# EAGLE schematic all_in_one_v2 (EAGLE 4.16)
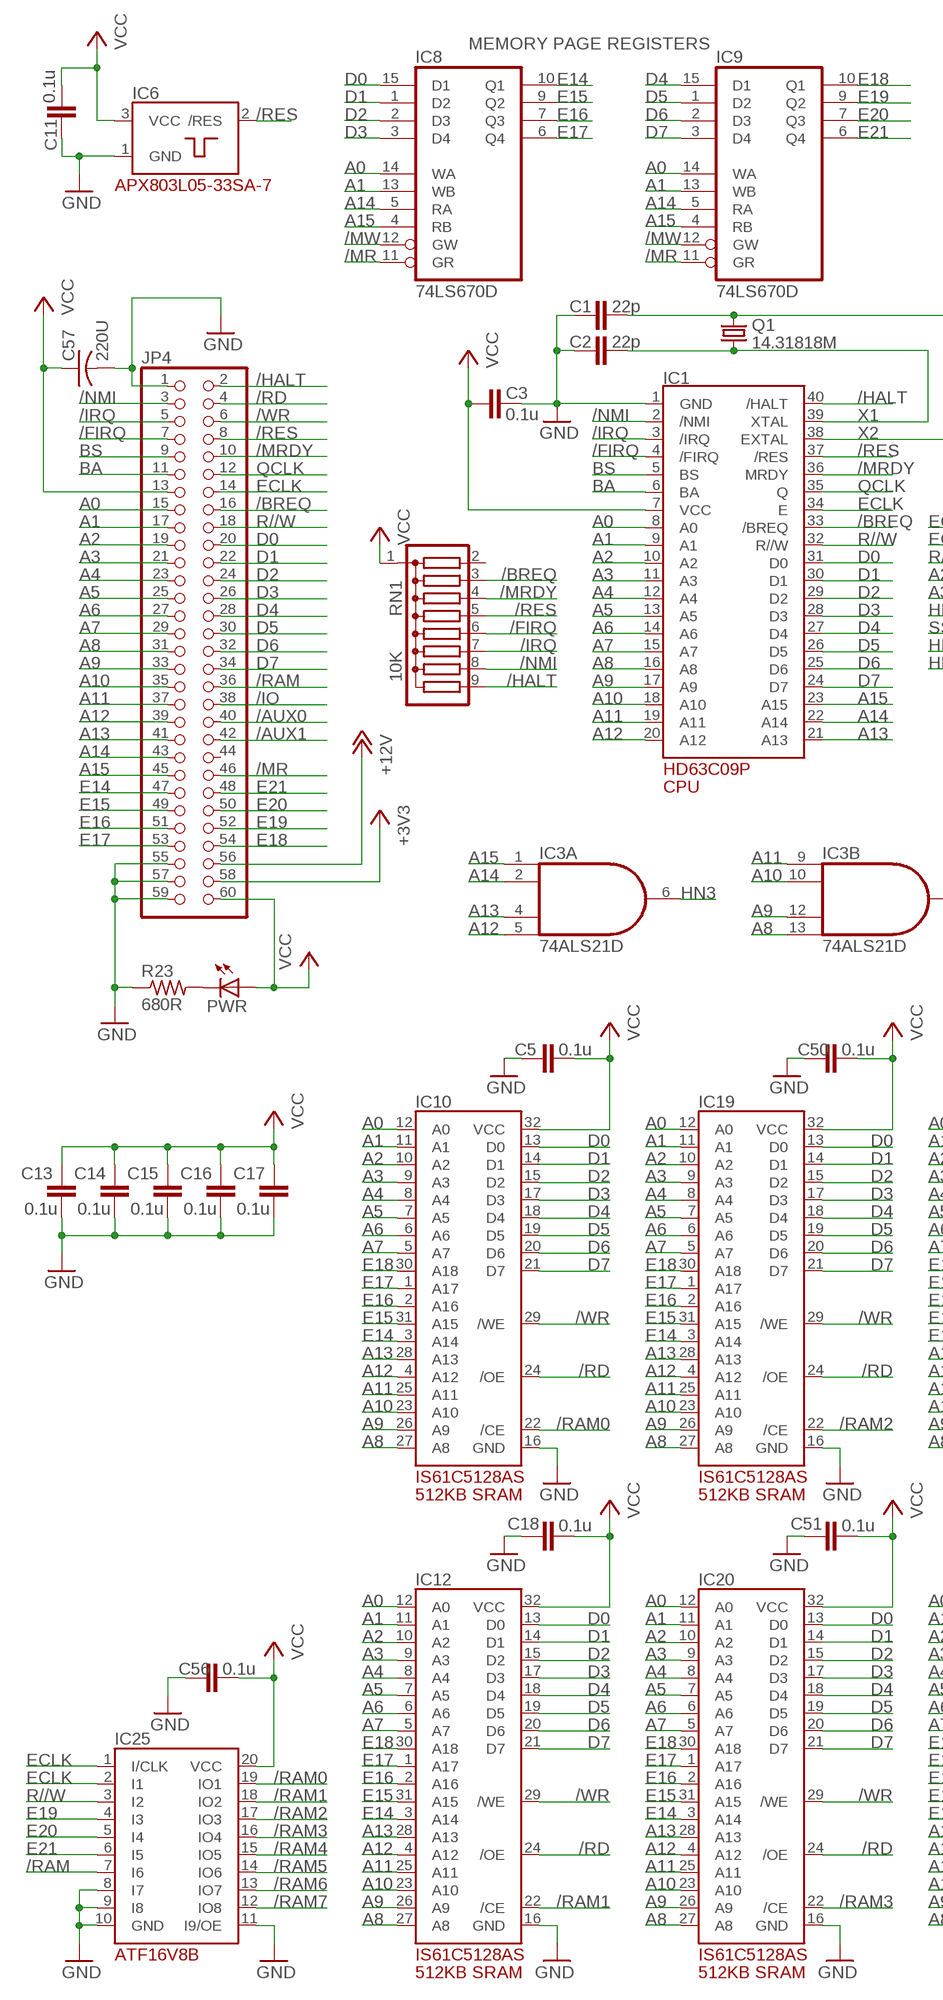
[diagram p0: schematic, sheet 1, part 1 of 2]
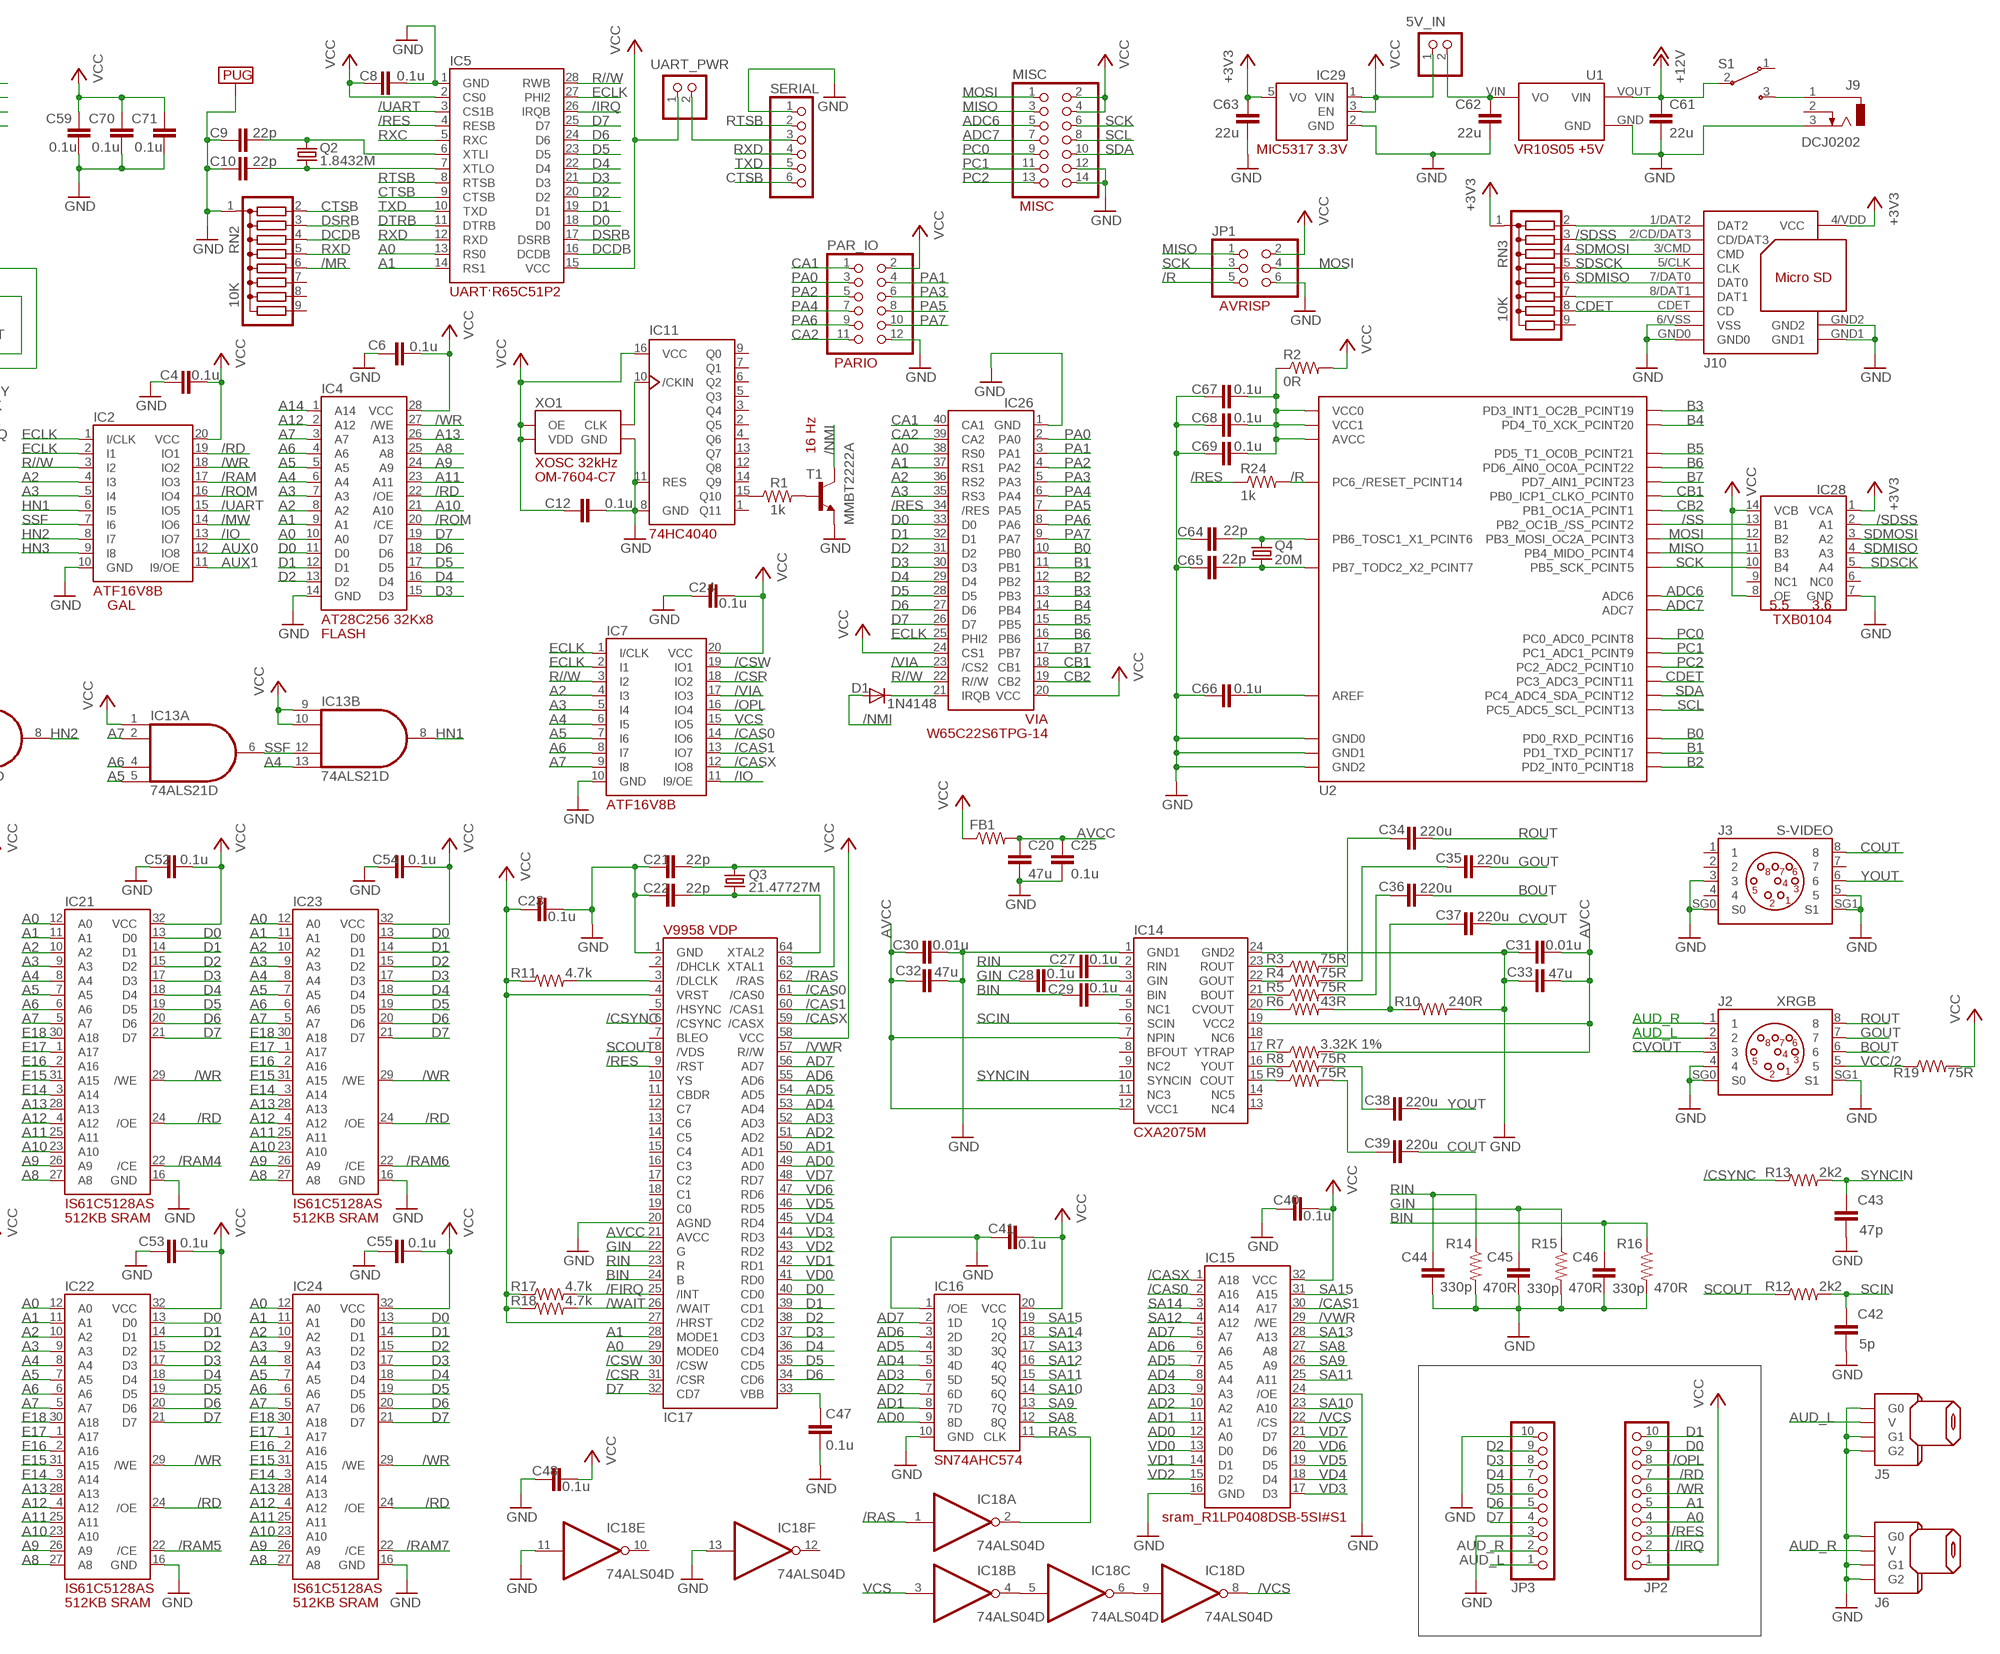
[diagram p1: schematic, sheet 1, part 2 of 2]

## Parts
5V_IN  PINHD-1X2  [1X02]
C1  22p  C-EUC0603  [C0603]
C2  22p  C-EUC0603  [C0603]
C3  0.1u  C-EUC0603  [C0603]
C4  0.1u  C-EUC0603  [C0603]
C5  0.1u  C-EUC0603  [C0603]
C6  0.1u  C-EUC0603  [C0603]
C8  0.1u  C-EUC0603  [C0603]
C9  22p  C-EUC0603  [C0603]
C10  22p  C-EUC0603  [C0603]
C11  0.1u  C-EUC0603  [C0603]
C12  0.1u  C-EUC0603  [C0603]
C13  0.1u  C-EUC0603  [C0603]
C14  0.1u  C-EUC0603  [C0603]
C15  0.1u  C-EUC0603  [C0603]
C16  0.1u  C-EUC0603  [C0603]
C17  0.1u  C-EUC0603  [C0603]
C18  0.1u  C-EUC0603  [C0603]
C20  47u  C-EUC0805  [C0805]
C21  22p  C-EUC0603  [C0603]
C22  22p  C-EUC0603  [C0603]
C23  0.1u  C-EUC0603  [C0603]
C24  0.1u  C-EUC0603  [C0603]
C25  0.1u  C-EUC0603  [C0603]
C27  0.1u  C-EUC0603  [C0603]
C28  0.1u  C-EUC0603  [C0603]
C29  0.1u  C-EUC0603  [C0603]
C30  0.01u  C-EUC0603  [C0603]
C31  0.01u  C-EUC0603  [C0603]
C32  47u  C-EUC0805  [C0805]
C33  47u  C-EUC0805  [C0805]
C34  220u  C-EUC1206  [C1206]
C35  220u  C-EUC1206  [C1206]
C36  220u  C-EUC1206  [C1206]
C37  220u  C-EUC1206  [C1206]
C38  220u  C-EUC1206  [C1206]
C39  220u  C-EUC1206  [C1206]
C40  0.1u  C-EUC0603  [C0603]
C41  0.1u  C-EUC0603  [C0603]
C42  5p  C-EUC0603  [C0603]
C43  47p  C-EUC0603  [C0603]
C44  330p  C-EUC0603  [C0603]
C45  330p  C-EUC0603  [C0603]
C46  330p  C-EUC0603  [C0603]
C47  0.1u  C-EUC0603  [C0603]
C48  0.1u  C-EUC0603  [C0603]
C50  0.1u  C-EUC0603  [C0603]
C51  0.1u  C-EUC0603  [C0603]
C52  0.1u  C-EUC0603  [C0603]
C53  0.1u  C-EUC0603  [C0603]
C54  0.1u  C-EUC0603  [C0603]
C55  0.1u  C-EUC0603  [C0603]
C56  0.1u  C-EUC0603  [C0603]
C57  220U  C-US025-050X050  [C025-050X050]
C59  0.1u  C-EUC0603  [C0603]
C61  22u  C-EUC1206  [C1206]
C62  22u  C-EUC1206  [C1206]
C63  22u  C-EUC0805  [C0805]
C64  22p  C-EUC0603  [C0603]
C65  22p  C-EUC0603  [C0603]
C66  0.1u  C-EUC0603  [C0603]
C67  0.1u  C-EUC0603  [C0603]
C68  0.1u  C-EUC0603  [C0603]
C69  0.1u  C-EUC0603  [C0603]
C70  0.1u  C-EUC0603  [C0603]
C71  0.1u  C-EUC0603  [C0603]
D1  1N4148  [DO35-10]
FB1  R-US_R0603  [R0603]
IC1  HD63C09P  [DIL40]
IC2  PLD_ATF16V8B  [DIL20]
IC3  74ALS21D  [SO14]
IC4  EEP_32KX8_AT28C256  [DIL28-6]
IC5  UART_W65C51N  [DIL28-6]
IC6  POR_APX803L05-33SA-7  [SOT23]
IC7  PLD_ATF16V8B  [DIL20]
IC8  74LS670D  [SO16]
IC9  74LS670D  [SO16]
IC10  IS61C5128AS  [SOIC32_11.3MM_WID]
IC11  74HC4040D  [SO16]
IC12  IS61C5128AS  [SOIC32_11.3MM_WID]
IC13  74ALS21D  [SO14]
IC14  CXA2075M  [CXA2075M]
IC15  R1LP0408DSB-5SI#S1  [RENESAS_32-TSOP-II]
IC16  SN74AHC574PWRSO  [SOIC20]
IC17  YAMAHA_V9958  [V9958]
IC18  74ALS04D  [SO14]
IC19  IS61C5128AS  [SOIC32_11.3MM_WID]
IC20  IS61C5128AS  [SOIC32_11.3MM_WID]
IC21  IS61C5128AS  [SOIC32_11.3MM_WID]
IC22  IS61C5128AS  [SOIC32_11.3MM_WID]
IC23  IS61C5128AS  [SOIC32_11.3MM_WID]
IC24  IS61C5128AS  [SOIC32_11.3MM_WID]
IC25  PLD_ATF16V8B  [DIL20]
IC26  W65C22S6TBG-14  [DIL40]
IC28  TXB0104D  [SOIC14]
IC29  MIC5317_3.3V  [SOT23-5]
J2  XRGB  MINI-DIN8  [MINI_DIN8]
J3  S-VIDEO  MINI-DIN8  [MINI_DIN8]
J5  RCA_CONN_CUI_RCJ-014_CP-1403-ND  [RCA_JACK_CUI_RCJ-014_CP-1403-ND]
J6  RCA_CONN_CUI_RCJ-014_CP-1403-ND  [RCA_JACK_CUI_RCJ-014_CP-1403-ND]
J9  DCJ0202  [DCJ0202]
J10  MICROSD_AMPHENOL_GTFP084328  [MICROSD_AMPHENOL_GTFP08432B1HR]
JP1  PINHD-2X3  [2X03]
JP2  PINHD-1X10  [1X10]
JP3  PINHD-1X10  [1X10]
JP4  PINHD-2X30  [2X30]
MISC  PINHD-2X7  [2X07]
PAR_IO  PINHD-2X6  [2X06]
PWR  LED3MM  [LED3MM]
Q1  14.31818M  CRYSTALHC49S  [HC49/S]
Q2  1.8432M  CRYSTALHC49S  [HC49/S]
Q3  21.47727M  CRYSTALHC49S  [HC49/S]
Q4  20M  CRYSTALHC49S  [HC49/S]
R1  1k  R-US_R0603  [R0603]
R2  0R  R-US_R0603  [R0603]
R3  75R  R-US_R0603  [R0603]
R4  75R  R-US_R0603  [R0603]
R5  75R  R-US_R0603  [R0603]
R6  43R  R-US_R0603  [R0603]
R7  3.32K 1%  R-US_R0603  [R0603]
R8  75R  R-US_R0603  [R0603]
R9  75R  R-US_R0603  [R0603]
R10  240R  R-US_R0603  [R0603]
R11  4.7k  R-US_R0603  [R0603]
R12  2k2  R-US_R0603  [R0603]
R13  2k2  R-US_R0603  [R0603]
R14  470R  R-US_R0603  [R0603]
R15  470R  R-US_R0603  [R0603]
R16  470R  R-US_R0603  [R0603]
R17  4.7k  R-US_R0603  [R0603]
R18  4.7k  R-US_R0603  [R0603]
R19  75R  R-US_R0603  [R0603]
R23  680R  R-US_R0603  [R0603]
R24  1k  R-US_R0603  [R0603]
RN1  10K  G08R  [SIL9]
RN2  10K  G08R  [SIL9]
RN3  10K  G08R  [SIL9]
S1  ROCKEREG4328-ND  [ROCKER_SPDT_EG4328-ND]
SERIAL  PINHD-1X6  [1X06]
T1  MMBT2222A  MMBT2222ALT1-NPN-SOT23-BEC  [SOT23-BEC]
U1  VREG_5V_VR10S05  [VREG_5V_CP_POWER_VR10S05]
U2  ATMEGA238PTQFP_  [TQFP32-08]
U$2  PUG  [LARGE_PUG]
UART_PWR  PINHD-1X2  [1X02]
XO1  XODC_32KHZ_OM-7604-C7  [32K_XO_OM-7604-C7]

## Nets
+3V3 [supply]: C63.1 IC28.1(VCA) IC29.5(VO) J10.4/VDD(VCC) JP4.58 RN3.1
+12V [supply]: C61.1 JP4.56 S1.2 U1.VOUT(VIN)
/AUX0: JP4.40
/AUX1: JP4.42
/BREQ: IC1.33(/BREQ) JP4.16 RN1.3
/CAS0: IC7.14(IO6) IC15.2(A16) IC17.61(/CAS0)
/CAS1: IC7.13(IO7) IC15.30(A17) IC17.60(/CAS1)
/CASX: IC7.12(IO8) IC15.1(A18) IC17.59(/CASX)
/CSR: IC7.18(IO2) IC17.31(/CSR)
/CSW: IC7.19(IO1) IC17.30(/CSW)
/CSYNC: IC17.6(/CSYNC) R13.1
/DLCLK: IC17.3(/DLCLK) R11.2
/FIRQ: IC1.4(/FIRQ) IC17.25(/INT) JP4.7 R17.2 RN1.6
/HALT: IC1.40(/HALT) JP4.2 RN1.9
/IO: IC2.13(IO7) IC7.11(I9/OE) JP4.38
/IRQ: IC1.3(/IRQ) IC5.26(IRQB) JP2.2 JP4.5 RN1.7
/MR: IC8.11(GR) IC9.11(GR) JP4.46 RN2.6
/MRDY: IC1.36(MRDY) JP4.10 RN1.4
/MW: IC2.14(IO6) IC8.12(GW) IC9.12(GW)
/NMI: D1.A IC1.2(/NMI) JP4.3 RN1.8 T1.C
/OPL: IC7.16(IO4) JP2.8
/R: JP1.5 R24.2 U2.29(PC6_/RESET_PCINT14)
/RAM: IC2.17(IO3) IC25.7(I6) JP4.36
/RAM0: IC10.22(/CE) IC25.19(IO1)
/RAM1: IC12.22(/CE) IC25.18(IO2)
/RAM2: IC19.22(/CE) IC25.17(IO3)
/RAM3: IC20.22(/CE) IC25.16(IO4)
/RAM4: IC21.22(/CE) IC25.15(IO5)
/RAM5: IC22.22(/CE) IC25.14(IO6)
/RAM6: IC23.22(/CE) IC25.13(IO7)
/RAM7: IC24.22(/CE) IC25.12(IO8)
/RAS: IC17.62(/RAS) IC18.1(A:I)
/RD: IC2.19(IO1) IC4.22(/OE) IC10.24(/OE) IC12.24(/OE) IC19.24(/OE) IC20.24(/OE) IC21.24(/OE) IC22.24(/OE) IC23.24(/OE) IC24.24(/OE) JP2.7 JP4.4
/RES: IC1.37(/RES) IC5.4(RESB) IC6.2(/RES) IC17.9(/RST) IC26.34(/RES) JP2.3 JP4.8 R24.1 RN1.5
/ROM: IC2.16(IO4) IC4.20(/CE)
/SDSS: IC28.2(A1) J10.2/CD/DAT3(CD/DAT3) RN3.3
/SS: IC28.13(B1) U2.14(PB2_OC1B_/SS_PCINT2)
/UART: IC2.15(IO5) IC5.3(CS1B)
/VCS: IC15.22(/CS) IC18.8(D:O)
/VIA: IC7.17(IO3) IC26.23(/CS2)
/VWR: IC15.29(/WE) IC17.57(R//W)
/WAIT: IC17.26(/WAIT) R18.2
/WR: IC2.18(IO2) IC4.27(/WE) IC10.29(/WE) IC12.29(/WE) IC19.29(/WE) IC20.29(/WE) IC21.29(/WE) IC22.29(/WE) IC23.29(/WE) IC24.29(/WE) JP2.6 JP4.6
A0: IC1.8(A0) IC4.10(A0) IC5.13(RS0) IC8.14(WA) IC9.14(WA) IC10.12(A0) IC12.12(A0) IC17.29(MODE0) IC19.12(A0) IC20.12(A0) IC21.12(A0) IC22.12(A0) IC23.12(A0) IC24.12(A0) IC26.38(RS0) JP2.4 JP4.15
A1: IC1.9(A1) IC4.9(A1) IC5.14(RS1) IC8.13(WB) IC9.13(WB) IC10.11(A1) IC12.11(A1) IC17.28(MODE1) IC19.11(A1) IC20.11(A1) IC21.11(A1) IC22.11(A1) IC23.11(A1) IC24.11(A1) IC26.37(RS1) JP2.5 JP4.17
A2: IC1.10(A2) IC2.4(I3) IC4.8(A2) IC7.4(I3) IC10.10(A2) IC12.10(A2) IC19.10(A2) IC20.10(A2) IC21.10(A2) IC22.10(A2) IC23.10(A2) IC24.10(A2) IC26.36(RS2) JP4.19
A3: IC1.11(A3) IC2.5(I4) IC4.7(A3) IC7.5(I4) IC10.9(A3) IC12.9(A3) IC19.9(A3) IC20.9(A3) IC21.9(A3) IC22.9(A3) IC23.9(A3) IC24.9(A3) IC26.35(RS3) JP4.21
A4: IC1.12(A4) IC4.6(A4) IC7.6(I5) IC10.8(A4) IC12.8(A4) IC13.13(B:I3) IC19.8(A4) IC20.8(A4) IC21.8(A4) IC22.8(A4) IC23.8(A4) IC24.8(A4) JP4.23
A5: IC1.13(A5) IC4.5(A5) IC7.7(I6) IC10.7(A5) IC12.7(A5) IC13.5(A:I3) IC19.7(A5) IC20.7(A5) IC21.7(A5) IC22.7(A5) IC23.7(A5) IC24.7(A5) JP4.25
A6: IC1.14(A6) IC4.4(A6) IC7.8(I7) IC10.6(A6) IC12.6(A6) IC13.4(A:I2) IC19.6(A6) IC20.6(A6) IC21.6(A6) IC22.6(A6) IC23.6(A6) IC24.6(A6) JP4.27
A7: IC1.15(A7) IC4.3(A7) IC7.9(I8) IC10.5(A7) IC12.5(A7) IC13.2(A:I1) IC19.5(A7) IC20.5(A7) IC21.5(A7) IC22.5(A7) IC23.5(A7) IC24.5(A7) JP4.29
A8: IC1.16(A8) IC3.13(B:I3) IC4.25(A8) IC10.27(A8) IC12.27(A8) IC19.27(A8) IC20.27(A8) IC21.27(A8) IC22.27(A8) IC23.27(A8) IC24.27(A8) JP4.31
A9: IC1.17(A9) IC3.12(B:I2) IC4.24(A9) IC10.26(A9) IC12.26(A9) IC19.26(A9) IC20.26(A9) IC21.26(A9) IC22.26(A9) IC23.26(A9) IC24.26(A9) JP4.33
A10: IC1.18(A10) IC3.10(B:I1) IC4.21(A10) IC10.23(A10) IC12.23(A10) IC19.23(A10) IC20.23(A10) IC21.23(A10) IC22.23(A10) IC23.23(A10) IC24.23(A10) JP4.35
A11: IC1.19(A11) IC3.9(B:I0) IC4.23(A11) IC10.25(A11) IC12.25(A11) IC19.25(A11) IC20.25(A11) IC21.25(A11) IC22.25(A11) IC23.25(A11) IC24.25(A11) JP4.37
A12: IC1.20(A12) IC3.5(A:I3) IC4.2(A12) IC10.4(A12) IC12.4(A12) IC19.4(A12) IC20.4(A12) IC21.4(A12) IC22.4(A12) IC23.4(A12) IC24.4(A12) JP4.39
A13: IC1.21(A13) IC3.4(A:I2) IC4.26(A13) IC10.28(A13) IC12.28(A13) IC19.28(A13) IC20.28(A13) IC21.28(A13) IC22.28(A13) IC23.28(A13) IC24.28(A13) JP4.41
A14: IC1.22(A14) IC3.2(A:I1) IC4.1(A14) IC8.5(RA) IC9.5(RA) JP4.43
A15: IC1.23(A15) IC3.1(A:I0) IC8.4(RB) IC9.4(RB) JP4.45
AD0: IC15.12(A0) IC16.9(8D) IC17.49(AD0)
AD1: IC15.11(A1) IC16.8(7D) IC17.50(AD1)
AD2: IC15.10(A2) IC16.7(6D) IC17.51(AD2)
AD3: IC15.9(A3) IC16.6(5D) IC17.52(AD3)
AD4: IC15.8(A4) IC16.5(4D) IC17.53(AD4)
AD5: IC15.7(A5) IC16.4(3D) IC17.54(AD5)
AD6: IC15.6(A6) IC16.3(2D) IC17.55(AD6)
AD7: IC15.5(A7) IC16.2(1D) IC17.56(AD7)
ADC6: MISC.5 U2.19(ADC6)
ADC7: MISC.7 U2.22(ADC7)
AUD_L: J2.2 J5.V JP3.1
AUD_R: J2.1 J6.V JP3.2
AUX0: IC2.12(IO8)
AUX1: IC2.11(I9/OE)
AVCC [supply]: C20.1 C25.1 C30.1 C31.2 C32.1 C33.2 FB1.2 IC14.7(NPIN) IC14.12(VCC1) IC14.19(VCC2) IC17.21(AVCC) R7.2
B0: IC26.10(PB0) U2.30(PD0_RXD_PCINT16)
B1: IC26.11(PB1) U2.31(PD1_TXD_PCINT17)
B2: IC26.12(PB2) U2.32(PD2_INT0_PCINT18)
B3: IC26.13(PB3) U2.1(PD3_INT1_OC2B_PCINT19)
B4: IC26.14(PB4) U2.2(PD4_T0_XCK_PCINT20)
B5: IC26.15(PB5) U2.9(PD5_T1_OC0B_PCINT21)
B6: IC26.16(PB6) U2.10(PD6_AIN0_OC0A_PCINT22)
B7: IC26.17(PB7) U2.11(PD7_AIN1_PCINT23)
BA: IC1.6(BA) JP4.11
BIN: C29.1 C46.1 IC17.24(B) R16.1
BOUT: C36.2 J2.6
BS: IC1.5(BS) JP4.9
CA1: IC26.40(CA1) PAR_IO.1
CA2: IC26.39(CA2) PAR_IO.11
CB1: IC26.18(CB1) U2.12(PB0_ICP1_CLKO_PCINT0)
CB2: IC26.19(CB2) U2.13(PB1_OC1A_PCINT1)
CDET: J10.CDET(CD) RN3.8 U2.26(PC3_ADC3_PCINT11)
COUT: C39.2 J3.8
CTSB: IC5.9(CTSB) RN2.2 SERIAL.6
CVOUT: C37.2 J2.3
D0: IC1.31(D0) IC4.11(D0) IC5.18(D0) IC8.15(D1) IC10.13(D0) IC12.13(D0) IC17.40(CD0) IC19.13(D0) IC20.13(D0) IC21.13(D0) IC22.13(D0) IC23.13(D0) IC24.13(D0) IC26.33(D0) JP2.9 JP4.20
D1: IC1.30(D1) IC4.12(D1) IC5.19(D1) IC8.1(D2) IC10.14(D1) IC12.14(D1) IC17.39(CD1) IC19.14(D1) IC20.14(D1) IC21.14(D1) IC22.14(D1) IC23.14(D1) IC24.14(D1) IC26.32(D1) JP2.10 JP4.22
D2: IC1.29(D2) IC4.13(D2) IC5.20(D2) IC8.2(D3) IC10.15(D2) IC12.15(D2) IC17.38(CD2) IC19.15(D2) IC20.15(D2) IC21.15(D2) IC22.15(D2) IC23.15(D2) IC24.15(D2) IC26.31(D2) JP3.9 JP4.24
D3: IC1.28(D3) IC4.15(D3) IC5.21(D3) IC8.3(D4) IC10.17(D3) IC12.17(D3) IC17.37(CD3) IC19.17(D3) IC20.17(D3) IC21.17(D3) IC22.17(D3) IC23.17(D3) IC24.17(D3) IC26.30(D3) JP3.8 JP4.26
D4: IC1.27(D4) IC4.16(D4) IC5.22(D4) IC9.15(D1) IC10.18(D4) IC12.18(D4) IC17.36(CD4) IC19.18(D4) IC20.18(D4) IC21.18(D4) IC22.18(D4) IC23.18(D4) IC24.18(D4) IC26.29(D4) JP3.7 JP4.28
D5: IC1.26(D5) IC4.17(D5) IC5.23(D5) IC9.1(D2) IC10.19(D5) IC12.19(D5) IC17.35(CD5) IC19.19(D5) IC20.19(D5) IC21.19(D5) IC22.19(D5) IC23.19(D5) IC24.19(D5) IC26.28(D5) JP3.6 JP4.30
D6: IC1.25(D6) IC4.18(D6) IC5.24(D6) IC9.2(D3) IC10.20(D6) IC12.20(D6) IC17.34(CD6) IC19.20(D6) IC20.20(D6) IC21.20(D6) IC22.20(D6) IC23.20(D6) IC24.20(D6) IC26.27(D6) JP3.5 JP4.32
D7: IC1.24(D7) IC4.19(D7) IC5.25(D7) IC9.3(D4) IC10.21(D7) IC12.21(D7) IC17.32(CD7) IC19.21(D7) IC20.21(D7) IC21.21(D7) IC22.21(D7) IC23.21(D7) IC24.21(D7) IC26.26(D7) JP3.4 JP4.34
DCDB: IC5.16(DCDB) RN2.4
DSRB: IC5.17(DSRB) RN2.3
DTRB: IC5.11(DTRB)
E14: IC8.10(Q1) IC10.3(A14) IC12.3(A14) IC19.3(A14) IC20.3(A14) IC21.3(A14) IC22.3(A14) IC23.3(A14) IC24.3(A14) JP4.47
E15: IC8.9(Q2) IC10.31(A15) IC12.31(A15) IC19.31(A15) IC20.31(A15) IC21.31(A15) IC22.31(A15) IC23.31(A15) IC24.31(A15) JP4.49
E16: IC8.7(Q3) IC10.2(A16) IC12.2(A16) IC19.2(A16) IC20.2(A16) IC21.2(A16) IC22.2(A16) IC23.2(A16) IC24.2(A16) JP4.51
E17: IC8.6(Q4) IC10.1(A17) IC12.1(A17) IC19.1(A17) IC20.1(A17) IC21.1(A17) IC22.1(A17) IC23.1(A17) IC24.1(A17) JP4.53
E18: IC9.10(Q1) IC10.30(A18) IC12.30(A18) IC19.30(A18) IC20.30(A18) IC21.30(A18) IC22.30(A18) IC23.30(A18) IC24.30(A18) JP4.54
E19: IC9.9(Q2) IC25.4(I3) JP4.52
E20: IC9.7(Q3) IC25.5(I4) JP4.50
E21: IC9.6(Q4) IC25.6(I5) JP4.48
ECLK: IC1.34(E) IC2.1(I/CLK) IC2.2(I1) IC5.27(PHI2) IC7.1(I/CLK) IC7.2(I1) IC25.1(I/CLK) IC25.2(I1) IC26.25(PHI2) JP4.14
GIN: C28.1 C45.1 IC17.22(G) R15.1
GND [lowpwr]: C1.1 C2.1 C3.2 C4.1 C5.1 C6.1 C8.2 C9.1 C10.1 C11.2 C12.2 C13.2 C14.2 C15.2 C16.2 C17.2 C18.1 C20.2 C21.1 C22.1 C23.2 C24.1 C25.2 C30.2 C31.1 C32.2 C33.1 C40.1 C41.1 C42.2 C43.2 C44.2 C45.2 C46.2 C47.2 C48.1 C50.1 C51.1 C52.1 C53.1 C54.1 C55.1 C56.1 C57.2 C59.2 C61.2 C62.2 C63.2 C64.1 C65.1 C66.1 C67.1 C68.1 C69.1 C70.2 C71.2 IC1.1(GND) IC2.10(GND) IC4.14(GND) IC5.1(GND) IC6.1(GND) IC7.10(GND) IC10.16(GND) IC11.8(GND) IC11.11(RES) IC12.16(GND) IC14.1(GND1) IC14.24(GND2) IC15.16(GND) IC15.24(/OE) IC16.1(/OE) IC16.10(GND) IC17.1(GND) IC17.20(AGND) IC18.11(E:I) IC18.13(F:I) IC19.16(GND) IC20.16(GND) IC21.16(GND) IC22.16(GND) IC23.16(GND) IC24.16(GND) IC25.8(I7) IC25.9(I8) IC25.10(GND) IC25.11(I9/OE) IC26.1(GND) IC28.7(GND) IC29.2(GND) J2.4 J2.SG0(S0) J2.SG1(S1) J3.3 J3.5 J3.SG0(S0) J3.SG1(S1) J5.G0 J5.G1 J5.G2 J6.G0 J6.G1 J6.G2 J9.3 J10.6/VSS(VSS) J10.GND0 J10.GND1 J10.GND2 JP1.6 JP3.3 JP3.10 JP4.1 JP4.55 JP4.57 JP4.59 MISC.12 MISC.14 PAR_IO.12 R10.2 R14.2 R15.2 R16.2 R23.1 RN2.1 SERIAL.1 T1.E U1.GND U2.3(GND0) U2.5(GND1) U2.21(GND2) U$2.P$1 XO1.GND
GOUT: C35.2 J2.7
HN1: IC2.6(I5) IC13.8(B:O)
HN2: IC2.8(I7) IC3.8(B:O)
HN3: IC2.9(I8) IC3.6(A:O)
MISO: IC28.11(B3) JP1.1 MISC.3 U2.16(PB4_MIDO_PCINT4)
MOSI: IC28.12(B2) JP1.4 MISC.1 U2.15(PB3_MOSI_OC2A_PCINT3)
N$1: R1.2 T1.B
N$2 [supply]: J9.1 S1.3
N$3: IC11.15(Q10) R1.1
N$4 [supply]: SERIAL.3 UART_PWR.2
N$5: IC11.10(/CKIN) XO1.CKOUT(CLK)
N$6: C21.2 IC17.63(XTAL1) Q3.2
N$7: C22.2 IC17.64(XTAL2) Q3.1
N$8: C27.2 IC14.2(RIN)
N$9: C28.2 IC14.3(GIN)
N$10: C29.2 IC14.4(BIN)
N$11: IC14.17(YTRAP) R7.1
N$12: IC14.23(ROUT) R3.1
N$13: IC14.22(GOUT) R4.1
N$14: IC14.21(BOUT) R5.1
N$15: IC14.20(CVOUT) R6.1
N$16: IC14.16(YOUT) R8.1
N$17: IC14.15(COUT) R9.1
N$18: C37.1 R6.2 R10.1
N$19: C39.1 R9.2
N$20: C9.2 IC5.6(XTLI) Q2.2
N$21: C10.2 IC5.7(XTLO) Q2.1
N$22: C38.1 R8.2
N$23: C36.1 R5.2
N$24: C35.1 R4.2
N$25: C34.1 R3.2
N$26: C47.1 IC17.33(VBB)
N$27: IC18.4(B:O) IC18.5(C:I)
N$28: IC18.6(C:O) IC18.9(D:I)
N$29 [lowpwr]: C67.2 C68.2 C69.2 R2.1 U2.4(VCC0) U2.6(VCC1) U2.18(AVCC)
N$30 [supply]: 5V_IN.2 C62.1 U1.VIN(VO)
N$31: PWR.K(C) R23.2
N$32: D1.C IC26.21(IRQB)
N$33: C64.2 Q4.2 U2.7(PB6_TOSC1_X1_PCINT6)
N$34: C65.2 Q4.1 U2.8(PB7_TODC2_X2_PCINT7)
N$35 [lowpwr]: C66.2 U2.20(AREF)
N$36: J10.1/DAT2(DAT2) RN3.2
N$37: J10.8/DAT1(DAT1) RN3.7
PA0: IC26.2(PA0) PAR_IO.3
PA1: IC26.3(PA1) PAR_IO.4
PA2: IC26.4(PA2) PAR_IO.5
PA3: IC26.5(PA3) PAR_IO.6
PA4: IC26.6(PA4) PAR_IO.7
PA5: IC26.7(PA5) PAR_IO.8
PA6: IC26.8(PA6) PAR_IO.9
PA7: IC26.9(PA7) PAR_IO.10
PC0: MISC.9 U2.23(PC0_ADC0_PCINT8)
PC1: MISC.11 U2.24(PC1_ADC1_PCINT9)
PC2: MISC.13 U2.25(PC2_ADC2_PCINT10)
QCLK: IC1.35(Q) JP4.12
R//W: IC1.32(R//W) IC2.3(I2) IC5.28(RWB) IC7.3(I2) IC25.3(I2) IC26.22(R//W) JP4.18
RAS: IC16.11(CLK) IC18.2(A:O)
RIN: C27.1 C44.1 IC17.23(R) R14.1
ROUT: C34.2 J2.8
RTSB: IC5.8(RTSB) SERIAL.2
RXC: IC5.5(RXC)
RXD: IC5.12(RXD) RN2.5 SERIAL.4
SA8: IC15.27(A8) IC16.12(8Q)
SA9: IC15.26(A9) IC16.13(7Q)
SA10: IC15.23(A10) IC16.14(6Q)
SA11: IC15.25(A11) IC16.15(5Q)
SA12: IC15.4(A12) IC16.16(4Q)
SA13: IC15.28(A13) IC16.17(3Q)
SA14: IC15.3(A14) IC16.18(2Q)
SA15: IC15.31(A15) IC16.19(1Q)
SCIN: C42.1 IC14.6(SCIN) R12.2
SCK: IC28.10(B4) JP1.3 MISC.6 U2.17(PB5_SCK_PCINT5)
SCL: MISC.8 U2.28(PC5_ADC5_SCL_PCINT13)
SCOUT: IC17.8(/VDS) R12.1
SDA: MISC.10 U2.27(PC4_ADC4_SDA_PCINT12)
SDMISO: IC28.4(A3) J10.7/DAT0(DAT0) RN3.6
SDMOSI: IC28.3(A2) J10.3/CMD(CMD) RN3.4
SDSCK: IC28.5(A4) J10.5/CLK(CLK) RN3.5
SSF: IC2.7(I6) IC13.6(A:O) IC13.12(B:I2)
SYNCIN: C43.1 IC14.10(SYNCIN) R13.2
TXD: IC5.10(TXD) SERIAL.5
VCC [supply]: 5V_IN.1 C3.1 C4.2 C5.2 C6.2 C8.1 C11.1 C12.1 C13.1 C14.1 C15.1 C16.1 C17.1 C18.2 C23.1 C24.2 C40.2 C41.2 C48.2 C50.2 C51.2 C52.2 C53.2 C54.2 C55.2 C56.2 C57.1 C59.1 C70.1 C71.1 FB1.1 IC1.7(VCC) IC2.20(VCC) IC4.28(VCC) IC5.2(CS0) IC5.15(VCC) IC6.3(VCC) IC7.20(VCC) IC10.32(VCC) IC11.16(VCC) IC12.32(VCC) IC13.1(A:I0) IC13.9(B:I0) IC13.10(B:I1) IC15.32(VCC) IC16.20(VCC) IC17.4(VRST) IC17.27(/HRST) IC17.58(VCC) IC19.32(VCC) IC20.32(VCC) IC21.32(VCC) IC22.32(VCC) IC23.32(VCC) IC24.32(VCC) IC25.20(VCC) IC26.20(VCC) IC26.24(CS1) IC28.8(OE) IC28.14(VCB) IC29.1(VIN) IC29.3(EN) JP1.2 JP2.1 JP4.13 JP4.60 MISC.2 MISC.4 PAR_IO.2 PWR.A R2.2 R11.1 R17.1 R18.1 R19.2 RN1.1 UART_PWR.1 XO1.OE XO1.VDD
VCC/2: J2.5 R19.1
VCS: IC7.15(IO5) IC18.3(B:I)
VD0: IC15.13(D0) IC17.41(RD0)
VD1: IC15.14(D1) IC17.42(RD1)
VD2: IC15.15(D2) IC17.43(RD2)
VD3: IC15.17(D3) IC17.44(RD3)
VD4: IC15.18(D4) IC17.45(RD4)
VD5: IC15.19(D5) IC17.46(RD5)
VD6: IC15.20(D6) IC17.47(RD6)
VD7: IC15.21(D7) IC17.48(RD7)
X1: C2.2 IC1.39(XTAL) Q1.1
X2: C1.2 IC1.38(EXTAL) Q1.2
YOUT: C38.2 J3.6
Unconnected: IC11.1(Q11) IC11.2(Q5) IC11.3(Q4) IC11.4(Q6) IC11.5(Q3) IC11.6(Q2) IC11.7(Q1) IC11.9(Q0) IC11.12(Q8) IC11.13(Q7) IC11.14(Q9) IC14.5(NC1) IC14.8(BFOUT) IC14.9(NC2) IC14.11(NC3) IC14.13(NC4) IC14.14(NC5) IC14.18(NC6) IC17.2(/DHCLK) IC17.5(/HSYNC) IC17.7(BLEO) IC17.10(YS) IC17.11(CBDR) IC17.12(C7) IC17.13(C6) IC17.14(C5) IC17.15(C4) IC17.16(C3) IC17.17(C2) IC17.18(C1) IC17.19(C0) IC18.10(E:O) IC18.12(F:O) IC28.6(NC0) IC28.9(NC1) J3.1 J3.2 J3.4 J3.7 J9.2 JP4.44 RN1.2 RN2.7 RN2.8 RN2.9 RN3.9 S1.1

## Notes on the sheet
- MEMORY PAGE REGISTERS
- MISC
- AVRISP
- PARIO
- 16 Hz
- GAL
- FLASH
- CPU
- AUD_R
- AUD_L
- 512KB SRAM | 512KB SRAM | 512KB SRAM | 512KB SRAM
- 512KB SRAM | 512KB SRAM | 512KB SRAM | 512KB SRAM

## Power pins joined to a net without a drawn wire
GND: IC3.7(P:GND) IC8.8(GND) IC9.8(GND) IC13.7(P:GND) IC18.7(P:GND)
VCC: IC3.14(P:VCC) IC8.16(VCC) IC9.16(VCC) IC13.14(P:VCC) IC18.14(P:VCC)

## Library data of the parts
5V_IN UART_PWR = pinhead:PINHD-1X2: PIN HEADER
C1-C6 C8-C18 C20-C25 C27-C48 C50-C56 C59 C61-C71 = rcl:C-EU: CAPACITOR, European symbol
C57 = rcl:C-US: CAPACITOR, American symbol
D1 = diode:1N4148: DIODE high speed (Philips)
FB1 R1-R19 R23 R24 = rcl:R-US_: RESISTOR, American symbol
IC1 = 07-Retrocomputing:HD63C09P
IC2 IC7 IC25 = 07-Retrocomputing:PLD_ATF16V8B
IC3 IC13 = 74xx-us:74*21: Dual 4-input AND gate
IC4 = 07-Retrocomputing:EEP_32KX8_AT28C256
IC5 = 07-Retrocomputing:UART_W65C51N
IC6 = 07-Retrocomputing:POR_APX803L05-33SA-7
IC8 IC9 = 74xx-us:74*670: 4 by 4 REGISTER FILES, 3-state
IC10 IC12 IC19-IC24 = 07-Retrocomputing:IS61C5128AS
IC11 = 07-Retrocomputing:74HC4040
IC14 = 07-Retrocomputing:CXA2075M
IC15 = 07-Retrocomputing:R1LP0408DSB-5SI#S1
IC16 = 07-Retrocomputing:SN74AHC574PWR
IC17 = 07-Retrocomputing:YAMAHA_V9958
IC18 = 74xx-us:74*04: Hex INVERTER
IC26 = 07-Retrocomputing:W65C22S6TBG-14
IC28 = 07-Retrocomputing:TXB0104
IC29 = 07-Retrocomputing:MIC5317_3.3V
J2 J3 = 07-Retrocomputing:MINI-DIN8
J5 J6 = 07-Retrocomputing:RCA_CONN_CUI_RCJ-014_CP-1403-ND
J9 = con-jack:DCJ0202: DC POWER JACK Source: DCJ0202.pdf
J10 = 07-Retrocomputing:MICROSD_AMPHENOL_GTFP084328
JP1 = pinhead:PINHD-2X3: PIN HEADER
JP2 JP3 = pinhead:PINHD-1X10: PIN HEADER
JP4 = pinhead:PINHD-2X30: PIN HEADER
MISC = pinhead:PINHD-2X7: PIN HEADER
PAR_IO = pinhead:PINHD-2X6: PIN HEADER
PWR = led:LED: LED OSRAM: - CHIPLED LG R971, LG N971, LY N971, LG Q971, LY Q971, LO R971, LY R971 LH N974, LH R974 LS Q976, LO Q976, LY Q976 LO Q996 - Hyper CHIPLED LW Q18S LB Q993, LB Q99A, LB R99A - SideLED LS A670, LO A670, LY A670, LG A670, LP A670 LB A673, LV A673, LT A673, LW A673 LH A674 LY A675 LS A676, LA A676, LO A676, LY A676, LW A676 LS A679, LY A679, LG A679 - Hyper Micro SIDELED® LS Y876, LA Y876, LO Y876, LY Y876 LT Y87S - SmartLED LW L88C, LW L88S LB L89C, LB L89S, LG L890 LS L89K, LO L89K, LY L89K LS L896, LA L896, LO L896, LY L896 - TOPLED LS T670, LO T670, LY T670, LG T670, LP T670 LSG T670, LSP T670, LSY T670, LOP T670, LYG T670 LG T671, LOG T671, LSG T671 LB T673, LV T673, LT T673, LW T673 LH T674 LS T676, LA T676, LO T676, LY T676, LB T676, LH T676, LSB T676, LW T676 LB T67C, LV T67C, LT T67C, LS T67K, LO T67K, LY T67K, LW E67C LS E67B, LA E67B, LO E67B, LY E67B, LB E67C, LV E67C, LT E67C LW T67C LS T679, LY T679, LG T679 LS T770, LO T770, LY T770, LG T770, LP T770 LB T773, LV T773, LT T773, LW T773 LH T774 LS E675, LA E675, LY E675, LS T675 LS T776, LA T776, LO T776, LY T776, LB T776 LHGB T686 LT T68C, LB T68C - Hyper Mini TOPLED® LB M676 - Mini TOPLED Santana® LG M470 LS M47K, LO M47K, LY M47K Source: http://www.osram.convergy.de - LUMILED® LXK2-PW12-R00, LXK2-PW12-S00, LXK2-PW14-U00, LXK2-PW14-V00 LXK2-PM12-R00, LXK2-PM12-S00, LXK2-PM14-U00 LXK2-PE12-Q00, LXK2-PE12-R00, LXK2-PE12-S00, LXK2-PE14-T00, LXK2-PE14-U00 LXK2-PB12-K00, LXK2-PB12-L00, LXK2-PB12-M00, LXK2-PB14-N00, LXK2-PB14-P00, LXK2-PB14-Q00 LXK2-PR12-L00, LXK2-PR12-M00, LXK2-PR14-Q00, LXK2-PR14-R00 LXK2-PD12-Q00, LXK2-PD12-R00, LXK2-PD12-S00 LXK2-PH12-R00, LXK2-PH12-S00 LXK2-PL12-P00, LXK2-PL12-Q00, LXK2-PL12-R00 Source: www.luxeon.com
Q1-Q4 = crystal:CRYSTAL: CRYSTAL
RN1-RN3 = resistor-sil:G08R: SIL RESISTOR
S1 = 06_buttons_switches:ROCKER
SERIAL = pinhead:PINHD-1X6: PIN HEADER
T1 = transistor:*-NPN-: NPN Transistror
U1 = 07-Retrocomputing:VREG_5V_VR10S05
U2 = 02_atmel:ATMEGA238P
U$2 = 07-Retrocomputing:PUG
XO1 = 07-Retrocomputing:XODC_32KHZ_OM-7604-C7

## Net classes
0 default: width 0.203 mm, drill 0.203 mm, clearance 0.254 mm
1 supply: width 0.61 mm, drill 0.203 mm, clearance 0.305 mm
2 lowpwr: width 0.254 mm, drill 0.203 mm, clearance 0.254 mm